# Altium schematic sheet Power.SchDoc
size A4; SheetNumber: 3; SheetTotal: 5
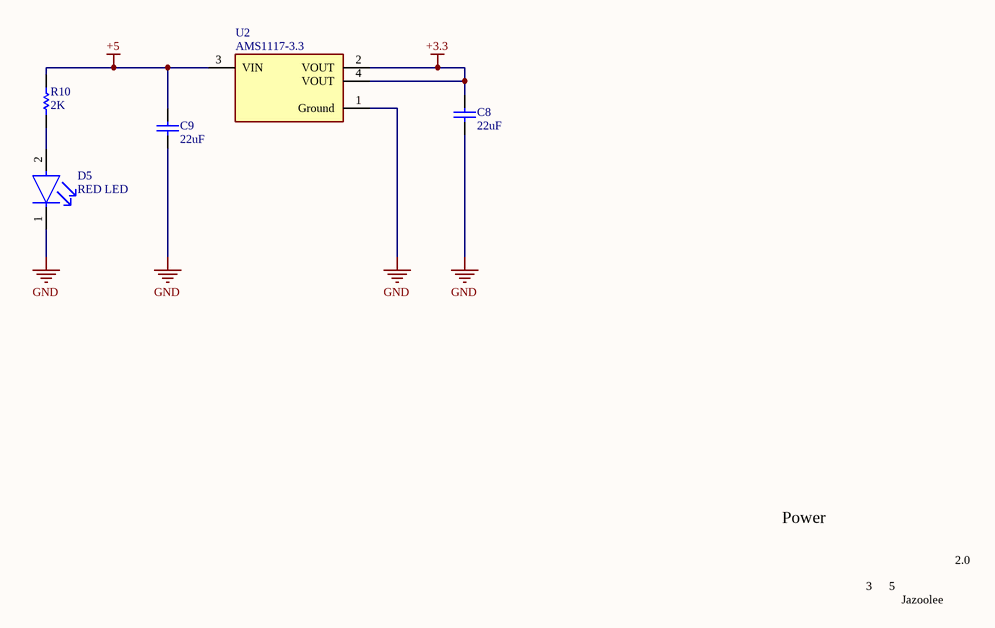
[diagram p0: Power.SchDoc]

## Parts
C8  value 22uF  [CAPC2014X150X70ML20]  (hidden comment: TACR226M010XTA)
C9  value 22uF  [CAPC2014X150X70ML20]  (hidden comment: TACR226M010XTA)
D5  Color: RED LED  [FP-HSMS-C150-MFG]  (hidden comment: HSMS-C150)
R10  value 2K  [RESC2013X60X35LL10T20]  (hidden comment: RT0805FRE072KL)
U2  AMS1117-3.3  [FP-AMS1117-IPC_A]

## Nets
+3.3: C8.2 U2.2(VOUT) U2.4(VOUT)
+5: C9.2 R10.2 U2.3(VIN)
GND: C8.1 C9.1 D5.1(C) U2.1(Ground)
NetD5_2: D5.2(A) R10.1

## Notes on the sheet
- Power
- 3
- 5
- 2.0
- Jazoolee

## Library data of the parts
C8 C9 = CMP-2007-00033-1: 22uF 10V 20% Tantalum 0805; Manufacturer: AVX Interconnect / Elco; Part Number: TACR226M010XTA
D5 = CMP-21615-000001-1: LED RED; Luminous Intensity: 10mcd; Power Dissipation: 65mW; Viewing Angle: 170°; Number of Elements: 1; Forward Current: 20mA; Lens Color: White; Lens Style: Rectangular; Wavelength: 626nm; Forward Voltage: 2.1V; Lens Transparency: Diffused; Reverse Voltage: 5V; Number of Pins: 2; Lead Free: Lead Free; Width: 1.6mm; Length: 3.2mm; REACH SVHC: No SVHC; Height: 1.1mm; Depth: 1.6mm; Power Rating: 65mW; Package Quantity: 1; Illumination Color: Red; Radiation Hardening: No; Case Code (Imperial): 1206; Max Operating Temperature: 85°C; Test Current: 20mA; Case/Package: 1206; Number of LEDs: 1; Packaging: Tape and Reel; Mount: Surface Mount; Min Operating Temperature: -40°C; Case Code (Metric): 3216; Dominant Wavelength: 626nm
R10 = CMP-2001-01475-1: Manufacturer: Yageo; Part Number: RT0805FRE072KL
U2 = CMP-209535-000001-1: LDO Voltage Regulators 1A, 3.3V; Manufacturer: Advanced Monolithic Systems; Dropout Voltage: 1.1V; Output Type: Fixed; Nominal Supply Current: 5mA; Max Power Dissipation: 1.2W; Max Supply Voltage: 15V; Number Of Outputs: 1; Standoff Height: 0.64mm; Max Junction Temp: +125°C; Height: 1.8mm; Package: AMS1117; Device Class L2: Power Management ICs; ComponentLink2Description: Datasheet; ComponentLink2URL: http://www.advanced-monolithic.com/pdf/ds1117.pdf; Category: IC; RoHS: TRUE; Automotive: No; Device Class L1: Integrated Circuits (ICs); Output Current: 1A; Device Class L3: Voltage Regulators - Linear; Temperature: -40°C to +125°C; Output Voltage: 3.3V; Manufacturer Part Number: AMS1117-3.3; Temperature Range Low: -40°C; Octopart: https://octopart.com/ams1117-3.3-advanced+monolithic+systems-25899300; Lead Free: Yes; Ipc Land Pattern Name: SOT229P700X180-4; Temperature Range High: +125°C